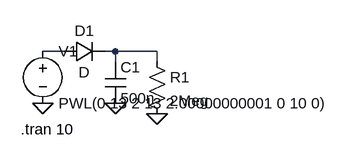
[diagram p0: schematic RC.asc]
RC.asc, the LTspice schematic file:
Version 4
SHEET 1 880 680
WIRE 96 112 64 112
WIRE 176 112 160 112
WIRE 240 112 176 112
WIRE 176 128 176 112
WIRE 240 128 240 112
FLAG 176 192 0
FLAG 240 208 0
FLAG 64 192 0
SYMBOL cap 160 128 R0
SYMATTR InstName C1
SYMATTR Value 500n
SYMBOL res 224 112 R0
SYMATTR InstName R1
SYMATTR Value 2Meg
SYMBOL voltage 64 96 R0
WINDOW 123 0 0 Left 0
WINDOW 39 0 0 Left 0
SYMATTR InstName V1
SYMATTR Value PWL(0 13 2 13 2.00000000001 0 10 0)
SYMBOL diode 96 128 R270
WINDOW 0 32 32 VTop 2
WINDOW 3 0 32 VBottom 2
SYMATTR InstName D1
TEXT 30 232 Left 2 !.tran 10

The netlist it stands for:
* RC.asc
C1 N002 0 500n
R1 N002 0 2Meg
V1 N001 0 PWL(0 13 2 13 2.00000000001 0 10 0)
D1 N001 N002 D
.model D D
.lib standard.dio
.tran 10
.backanno
.end